# EAGLE design vcf-v1 (EAGLE 9.5.2)
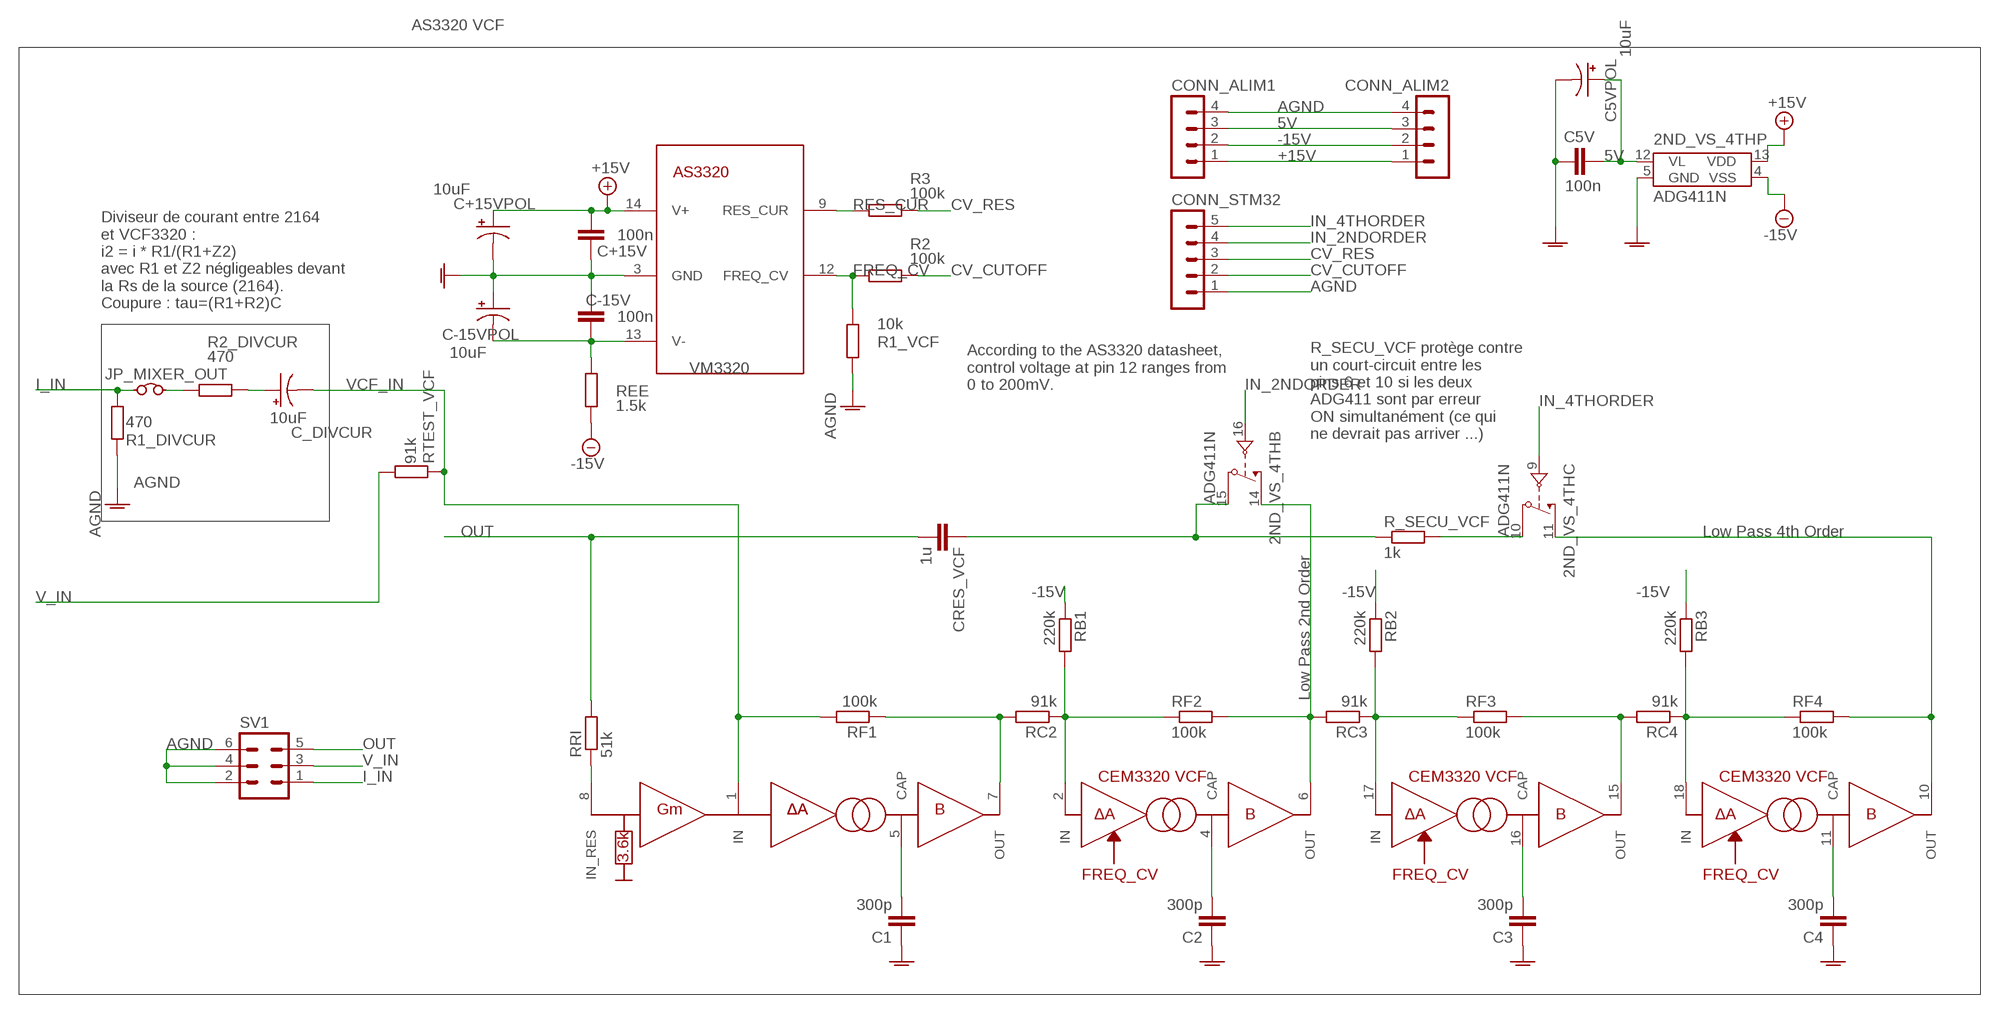
[diagram p0: schematic, sheet 1]

## Parts
2ND_VS_4TH  ADG411N  [DIL16]
C1  300p  C-EU050-024X044  [C050-024X044]
C2  300p  C-EU050-024X044  [C050-024X044]
C3  300p  C-EU075-032X103  [C075-032X103]
C4  300p  C-EU050-024X044  [C050-024X044]
C5V  100n  C-EU050-024X044  [C050-024X044]
C5VPOL  10uF  10UF-POLAR-RADIAL-2.5MM-KIT-25V-20%  [CPOL-RADIAL-2.5MM-5MM-KIT]
C+15V  100n  C-EU050-024X044  [C050-024X044]
C+15VPOL  10uF  10UF-POLAR-RADIAL-2.5MM-KIT-25V-20%  [CPOL-RADIAL-2.5MM-5MM-KIT]
C-15V  100n  C-EU050-024X044  [C050-024X044]
C-15VPOL  10uF  10UF-POLAR-RADIAL-2.5MM-KIT-25V-20%  [CPOL-RADIAL-2.5MM-5MM-KIT]
C_DIVCUR  10uF  10UF-POLAR-RADIAL-2.5MM-KIT-25V-20%  [CPOL-RADIAL-2.5MM-5MM-KIT]
CONN_ALIM1  MA04-1  [MA04-1]
CONN_ALIM2  MA04-1  [MA04-1]
CONN_STM32  MA05-1  [MA05-1]
CRES_VCF  1u  C-EU050-024X044  [C050-024X044]
JP_MIXER_OUT  JUMPER_WIRE  [JUMPER]
R1_DIVCUR  470  R-EU_0204/5  [0204/5]
R1_VCF  10k  R-EU_0204/5  [0204/5]
R2  100k  R-EU_0204/5  [0204/5]
R2_DIVCUR  470  R-EU_0204/5  [0204/5]
R3  100k  R-EU_0204/5  [0204/5]
R_SECU_VCF  1k  R-EU_0204/5  [0204/5]
RB1  220k  R-EU_0204/5  [0204/5]
RB2  220k  R-EU_0204/5  [0204/5]
RB3  220k  R-EU_0204/5  [0204/5]
RC2  91k  R-EU_0204/5  [0204/5]
RC3  91k  R-EU_0204/5  [0204/5]
RC4  91k  R-EU_0204/5  [0204/5]
REE  1.5k  R-EU_0204/5  [0204/5]
RF1  100k  R-EU_0204/5  [0204/5]
RF2  100k  R-EU_0204/5  [0204/5]
RF3  100k  R-EU_0204/5  [0204/5]
RF4  100k  R-EU_0204/5  [0204/5]
RRI  51k  R-EU_0204/5  [0204/5]
RTEST_VCF  91k  R-EU_0204/5  [0204/5]
SV1  MA03-2  [MA03-2]
VCF  AS3320  [DIL18]

## Nets
5V: 2ND_VS_4TH.12(P:VL) C5V.1 C5VPOL.1(+) CONN_ALIM1.3 CONN_ALIM2.3
+15V: 2ND_VS_4TH.13(P:VDD) C+15V.2 C+15VPOL.1(+) CONN_ALIM1.1 CONN_ALIM2.1 VCF.14(POW$1:V+)
-15V: 2ND_VS_4TH.4(P:VSS) CONN_ALIM1.2 CONN_ALIM2.2 RB1.1 RB2.1 RB3.1 REE.1
AGND: 2ND_VS_4TH.5(P:GND) C1.1 C2.1 C3.1 C4.1 C5V.2 C5VPOL.2(-) C+15V.1 C+15VPOL.2(-) C-15V.2 C-15VPOL.1(+) CONN_ALIM1.4 CONN_ALIM2.4 CONN_STM32.1 R1_DIVCUR.2 R1_VCF.2 SV1.2 SV1.4 SV1.6 VCF.3(POW$1:GND)
CV_CUTOFF: CONN_STM32.2 R2.2
CV_RES: CONN_STM32.3 R3.2
FREQ_CV: R1_VCF.1 R2.1 VCF.12(POW$1:FREQ_CV)
I_IN: JP_MIXER_OUT.1 R1_DIVCUR.1 SV1.1
IN_2NDORDER: 2ND_VS_4TH.16(B:IN) CONN_STM32.4
IN_4THORDER: 2ND_VS_4TH.9(C:IN) CONN_STM32.5
N$5: C1.2 VCF.5(OTA$1:CAP)
N$17: C3.2 VCF.16(OTA$4:CAP)
N$18: C2.2 VCF.4(OTA$2:CAP)
N$24: C4.2 VCF.11(OTA$3:CAP)
N$57: RC2.2 RF1.1 VCF.7(OTA$1:OUT)
N$58: 2ND_VS_4TH.15(B:D) CRES_VCF.1 R_SECU_VCF.1
N$62: RB1.2 RC2.1 RF2.1 VCF.2(OTA$2:IN)
N$65: 2ND_VS_4TH.14(B:S) RC3.2 RF2.2 VCF.6(OTA$2:OUT)
N$69: 2ND_VS_4TH.11(C:S) RF4.2 VCF.10(OTA$3:OUT)
N$72: RB2.2 RC3.1 RF3.1 VCF.17(OTA$4:IN)
N$73: 2ND_VS_4TH.10(C:D) R_SECU_VCF.2
N$75: C_DIVCUR.1(+) R2_DIVCUR.1
N$79: JP_MIXER_OUT.2 R2_DIVCUR.2
N$82: RC4.2 RF3.2 VCF.15(OTA$4:OUT)
N$83: RB3.2 RC4.1 RF4.1 VCF.18(OTA$3:IN)
N$86: RRI.1 VCF.8(OTA$1:IN_RES)
OUT: CRES_VCF.2 RRI.2 SV1.5
RES_CUR: R3.1 VCF.9(POW$1:RES_CUR)
V_IN: RTEST_VCF.1 SV1.3
VCF_IN: C_DIVCUR.2(-) RF1.2 RTEST_VCF.2 VCF.1(OTA$1:IN)
VM3320: C-15V.1 C-15VPOL.2(-) REE.2 VCF.13(POW$1:V-)
Unconnected: 2ND_VS_4TH.1(A:IN) 2ND_VS_4TH.2(A:D) 2ND_VS_4TH.3(A:S) 2ND_VS_4TH.6(D:S) 2ND_VS_4TH.7(D:D) 2ND_VS_4TH.8(D:IN)

## Notes on the sheet
- AS3320 VCF
- Diviseur de courant entre 2164 
  et VCF3320 : 
  i2 = i * R1/(R1+Z2)
  avec R1 et Z2 négligeables devant
  la Rs de la source (2164).
  Coupure : tau=(R1+R2)C
- According to the AS3320 datasheet, 
  control voltage at pin 12 ranges from
  0 to 200mV.
- R_SECU_VCF protège contre 
  un court-circuit entre les 
  pins 6 et 10 si les deux 
  ADG411 sont par erreur 
  ON simultanément (ce qui 
  ne devrait pas arriver ...)
- Low Pass 4th Order
- Low Pass 2nd Order

## Library data of the parts
2ND_VS_4TH = analog-devices:ADG411: LC2MOS Precision Quad SPST Switches Source: http://www.analog.com/static/imported-files/data_sheets/ADG411_412_413.pdf; MF: ALTERA CORPORATION; MPN: ADG411BN; OC_FARNELL: 1424317; OC_NEWARK: 05F6198
C1-C4 C5V C+15V C-15V CRES_VCF = rcl:C-EU: CAPACITOR, European symbol; SPICEPREFIX: C
C5VPOL C+15VPOL C-15VPOL C_DIVCUR = SparkFun-Capacitors:10UF-POLAR: 10.0µF polarized capacitors A capacitor is a passive two-terminal electrical component used to store electrical energy temporarily in an electric field.; PROD_ID: CAP-08440
CONN_ALIM1 CONN_ALIM2 = con-lstb:MA04-1: PIN HEADER; OC_FARNELL: unknown; OC_NEWARK: unknown
CONN_STM32 = con-lstb:MA05-1: PIN HEADER; OC_FARNELL: unknown; OC_NEWARK: unknown
JP_MIXER_OUT = 6P1_EVB:JUMPER: Wire jumper .1" C
R1_DIVCUR R1_VCF R2 R2_DIVCUR R3 R_SECU_VCF RB1-RB3 RC2-RC4 REE RF1-RF4 RRI RTEST_VCF = rcl:R-EU_: RESISTOR, European symbol; SPICEPREFIX: R
SV1 = con-lstb:MA03-2: PIN HEADER; OC_FARNELL: unknown; OC_NEWARK: unknown
VCF = analog-audio-chips:AS3320: Voltage Controlled Filter capable of 4th order LP, BP or HP designed by famous audio chips designer Curtis Electronics.

## Board
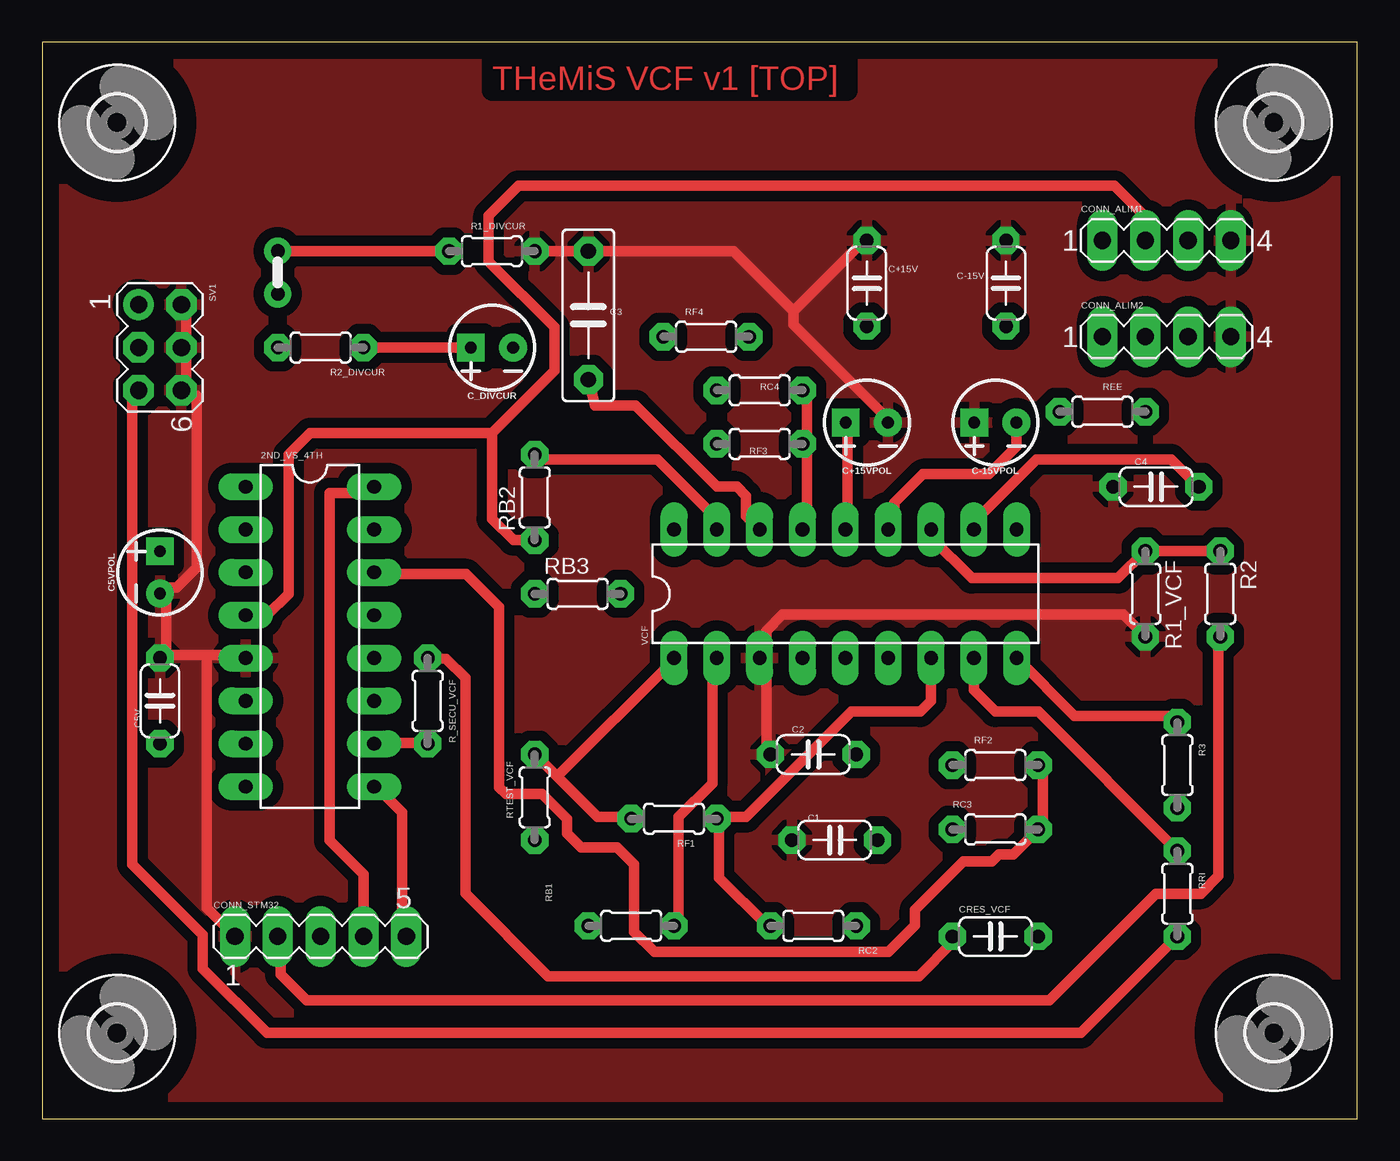
[diagram p1: board, top side]
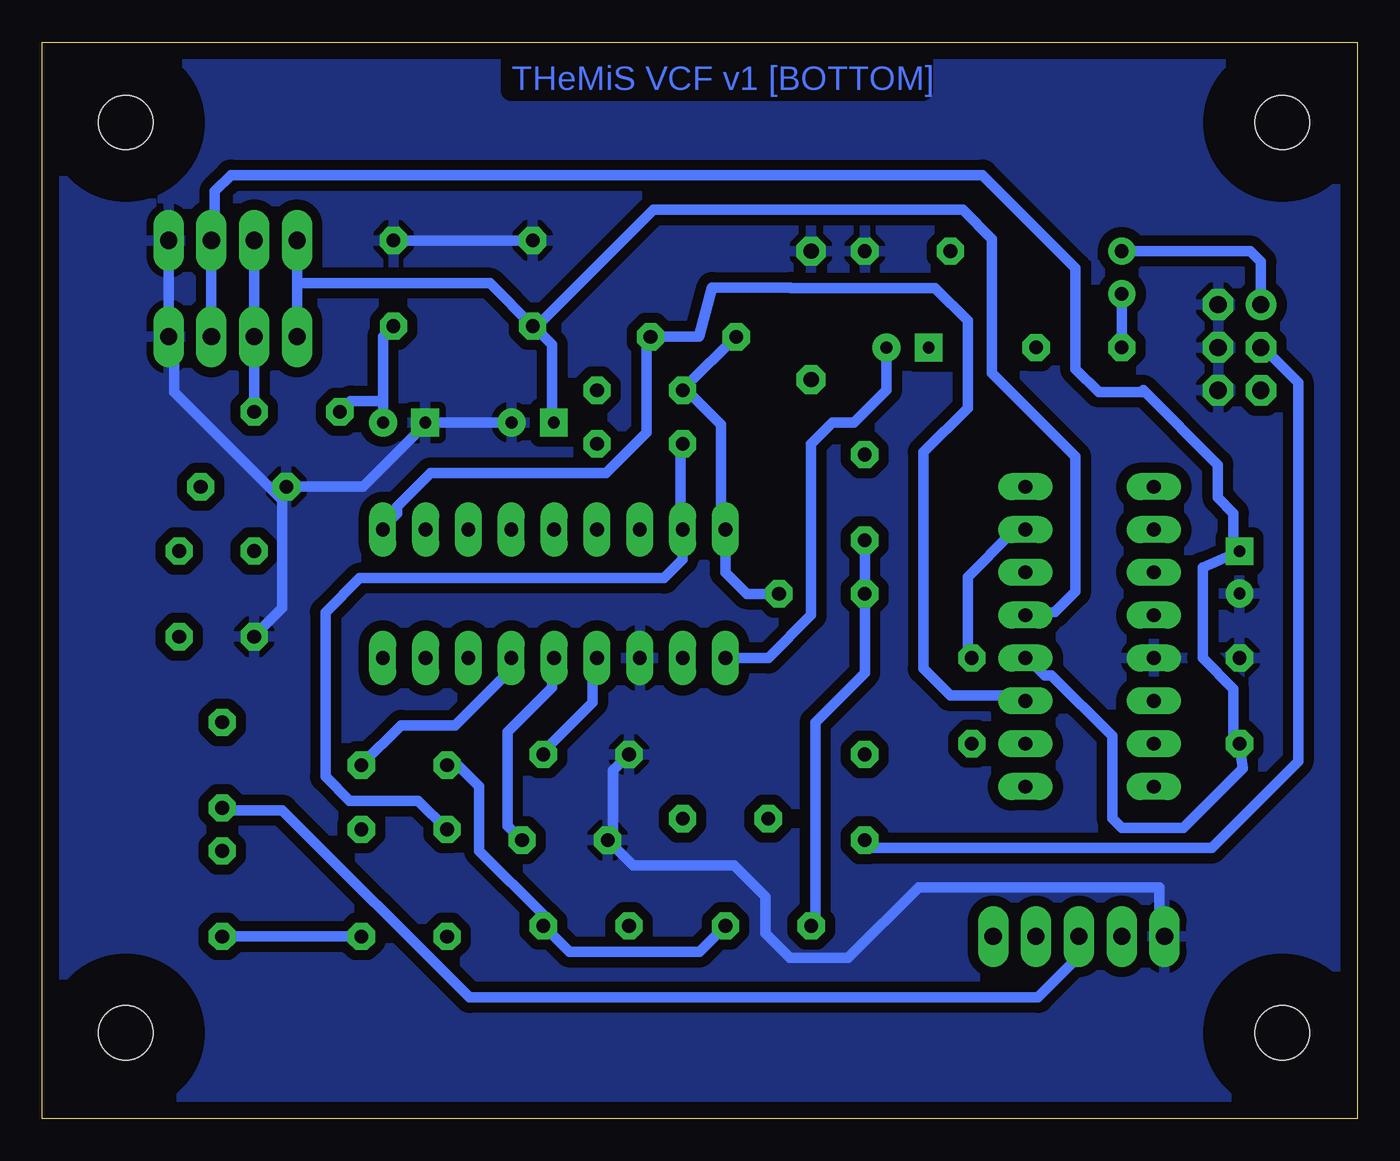
[diagram p2: board, bottom side, seen from below]

Size 77.98 x 63.82 mm. Coordinates in mm from the lower left corner, seen from the top.
Outline: 0,0 77.98,0 77.98,63.82 0,63.82 0,0
Copper layers (1*16): Top 0.035mm / dielectric 1.5mm / Bottom 0.035mm
Design rules "ENSEA_2019": minimum track width 0.4mm, minimum drill 0.6mm, track to track 0.4mm, track to pad 0.4mm, pad to pad 0.4mm, via to via 0.4mm, smd to smd 0.4mm, copper to edge 1mm, drill to drill 0.4mm, minimum pad ring 0.4mm, minimum via ring 0.4mm, stop-mask expansion 4mil, vias tented up to drill 0mil, thermal gap 0.4mm

### Footprints (pad centres in the part's own frame; a part is rotated, then mirrored left to right if it is on the bottom)
DIL16 = drill 0.813 long: 1 -8.89,-3.81; 2 -6.35,-3.81; 3 -3.81,-3.81; 4 -1.27,-3.81; 5 1.27,-3.81; 6 3.81,-3.81; 7 6.35,-3.81; 8 8.89,-3.81; 9 8.89,3.81; 10 6.35,3.81; 11 3.81,3.81; 12 1.27,3.81; 13 -1.27,3.81; 14 -3.81,3.81; 15 -6.35,3.81; 16 -8.89,3.81
C050-024X044 = drill 0.813 octagon: 1 -2.54,0; 2 2.54,0
C075-032X103 = drill 0.914 octagon: 1 -3.81,0; 2 3.81,0
CPOL-RADIAL-2.5MM-5MM-KIT = drill 0.7 pad 1.651 square: 1 1.25,0 | drill 0.7 pad 1.651: 2 -1.25,0
MA04-1 = drill 1.016 long: 1 -3.81,0; 2 -1.27,0; 3 1.27,0; 4 3.81,0
MA05-1 = drill 1.016 long: 1 -5.08,0; 2 -2.54,0; 3 0,0; 4 2.54,0; 5 5.08,0
JUMPER = drill 0.813: 1 -1.27,0; 2 1.27,0
0204/5 = drill 0.813 octagon: 1 -2.54,0; 2 2.54,0
MA03-2 = drill 1.016: 1 -2.54,-1.27 | drill 1.016 octagon: 2 -2.54,1.27; 3 0,-1.27; 4 0,1.27; 5 2.54,-1.27; 6 2.54,1.27
3,2 = hole 3.2: 0,0
DIL18 = drill 0.813 long: 1 -10.16,-3.81; 2 -7.62,-3.81; 3 -5.08,-3.81; 4 -2.54,-3.81; 5 0,-3.81; 6 2.54,-3.81; 7 5.08,-3.81; 8 7.62,-3.81; 9 10.16,-3.81; 10 10.16,3.81; 11 7.62,3.81; 12 5.08,3.81; 13 2.54,3.81; 14 0,3.81; 15 -2.54,3.81; 16 -5.08,3.81; 17 -7.62,3.81; 18 -10.16,3.81

### Placement (x,y rotation side)
2ND_VS_4TH  15.88,28.58 270 top
C1  46.99,16.51 0 top
C2  45.72,21.59 0 top
C3  32.38,47.62 270 top
C4  66.04,37.46 0 top
C5V  6.99,24.77 90 top
C5VPOL  6.99,32.38 90 top
C+15V  48.89,49.53 270 top
C+15VPOL  48.89,41.27 180 top
C-15V  57.15,49.53 90 top
C-15VPOL  56.52,41.27 180 top
C_DIVCUR  26.67,45.72 180 top
CONN_ALIM1  66.68,52.07 0 top
CONN_ALIM2  66.68,46.35 0 top
CONN_STM32  16.51,10.79 0 top
CRES_VCF  56.52,10.79 0 top
JP_MIXER_OUT  13.97,50.16 270 top
R1_DIVCUR  26.67,51.43 0 top
R1_VCF  65.41,31.12 270 top
R2  69.85,31.12 270 top
R2_DIVCUR  16.51,45.72 180 top
R3  67.31,20.95 270 top
R_SECU_VCF  22.86,24.77 270 top
RB1  34.92,11.43 0 top
RB2  29.21,36.83 90 top
RB3  31.75,31.12 0 top
RC2  45.72,11.43 180 top
RC3  56.52,17.14 0 top
RC4  42.55,43.18 0 top
REE  62.87,41.91 180 top
RF1  37.46,17.78 180 top
RF2  56.52,20.95 0 top
RF3  42.55,40 0 top
RF4  39.37,46.35 0 top
RRI  67.31,13.34 270 top
RTEST_VCF  29.21,19.05 90 top
SV1  6.99,45.72 270 top
U$1  [3,2]  4.45,59.05 0 top
U$2  [3,2]  73.03,59.05 0 top
U$3  [3,2]  73.03,5.08 0 top
U$4  [3,2]  4.45,5.08 0 top
VCF  47.62,31.12 0 top

### Tracks (layer width: path | path; a pad name or v marks a point on that pad's centre or on a via)
5V
  Bottom 0.61: 2ND_VS_4TH.12 19.34,27.08 18.54,26.28 18.14,26.28 14.54,22.68 14.54,17.81 13.98,17.24 10.3,17.24 6.79,20.76 C5V.1 7.34,22.28 7.34,25.48 9.18,27.31 9.18,32.68 C5VPOL.1 7.34,33.88 7.34,35.88 8.27,36.81 8.27,38.75 12.7,43.18 12.8,43.08 15.34,43.08 16.7,44.45 16.7,50.43 22.22,55.95 66.78,55.95 67.74,54.98 67.74,52.28 CONN_ALIM1.3 CONN_ALIM2.3
+15V
  Top 0.61: VCF.14 47.74,35.08 47.74,41.08 C+15VPOL.1
  Bottom 0.61: 2ND_VS_4TH.13 17.93,30.02 16.7,31.24 16.7,39.24 21.67,44.21 21.67,52.15 23.4,53.88 41.74,53.88 48.63,46.99 C+15V.2 | C+15VPOL.1 47.74,41.48 47.74,45.88 48.54,46.68 C+15V.2 | C+15V.2 51.44,49.53 62.87,49.53 | 62.87,49.53 CONN_ALIM1.1 | 62.87,49.53 CONN_ALIM2.1
-15V
  Top 0.61: 12.14,29.88 2ND_VS_4TH.4 13.34,29.84 14.61,31.12 14.61,39.37 15.88,40.64 26.67,40.64 | 26.67,40.64 26.67,35.56 27.94,34.29 RB2.1 | CONN_ALIM1.2 65.41,53.48 63.57,55.31 28.23,55.31 26.47,53.55 26.47,50.82 30.38,46.91 30.38,44.34 26.67,40.64
  Bottom 0.61: RB2.1 RB3.1 29.21,26.42 32.14,23.49 32.14,11.68 RB1.1 | CONN_ALIM1.2 CONN_ALIM2.2 REE.1
AGND
  Top 0.61: SV1.2 8.54,47.88 8.54,45.88 SV1.4 8.54,45.48 8.54,43.48 SV1.6 9.18,42.86 9.18,32.68 7.97,31.48 7.34,31.48 C5VPOL.2 7.34,31.08 7.34,27.48 | 7.34,27.48 9.74,27.48 | 9.74,27.48 11.74,27.48 2ND_VS_4TH.5 | 7.34,27.48 C5V.2 | C2.1 42.94,21.88 42.94,27.08 VCF.3 42.94,27.7 42.94,28.91 43.91,29.88 64.1,29.88 R1_VCF.2 | 44.54,47.88 44.54,47.08 50.14,41.48 C+15VPOL.2 | 9.74,27.48 9.74,12.48 CONN_STM32.1 | C+15V.1 48.73,52.07 44.54,47.88 | 44.54,47.88 40.98,51.43 C3.1 R1_DIVCUR.2
  Bottom 0.61: 63.74,36.68 63.74,30.28 65.34,28.68 R1_VCF.2 | 63.74,36.68 63.74,37.08 C4.1 | C4.1 63.34,37.48 58.94,37.48 55.34,41.08 C-15VPOL.1 C+15VPOL.2 | 63.74,36.68 70.14,43.08 70.14,46.28 CONN_ALIM2.4 CONN_ALIM1.4 | 63.74,36.68 C4.1 | CONN_STM32.1 11.74,11.11 11.74,13.71 26,13.71 30.19,9.53 33.66,9.53 35.11,10.98 35.11,13.15 36.96,15.01 42.95,15.01 C1.1 44.14,16.82 44.14,20.63 C2.1 | C+15V.1 C-15V.2
  pour Bottom (isolate 0.61): 0,63.5 77.47,63.5 77.47,0 0,0
  pour Top (isolate 0.61): 0,63.5 78.11,63.5 78.11,0 0,0
CV_CUTOFF
  Top 0.61: CONN_STM32.2 14.14,10.62 14.14,8.54 15.67,7.01 59.71,7.01 66.04,13.34 68.7,13.34 69.74,14.38 69.74,28.47 R2.2
CV_RES
  Bottom 0.61: CONN_STM32.3 16.51,9.61 18.94,7.18 52.63,7.18 63.74,18.28 67.18,18.28 R3.2
FREQ_CV
  Top 0.61: R2.1 R1_VCF.1 63.8,32.05 55.12,32.05 52.7,34.45 VCF.12
I_IN
  Top 0.61: R1_DIVCUR.1 JP_MIXER_OUT.1
  Bottom 0.61: SV1.1 5.71,50.8 6.35,51.43 JP_MIXER_OUT.1
IN_2NDORDER
  Top 0.61: 2ND_VS_4TH.16 19.3,37.08 17.04,37.08 17.04,16.49 19.05,14.47 CONN_STM32.4
IN_4THORDER
  Top 0.61: 2ND_VS_4TH.9 19.81,19.69 21.34,18.16 21.34,11.01 CONN_STM32.5
N$5
  Bottom 0.61: C1.2 50.38,17.36 50.38,22.91 47.74,25.55 47.74,27.19 VCF.5
N$17
  Top 0.61: VCF.16 41.74,35.73 41.74,36.91 41.19,37.46 40.01,37.46 35.19,42.28 32.79,42.28 C3.2
N$18
  Bottom 0.61: C2.2 48.26,21.76 45.34,24.68 45.34,27.05 VCF.4
N$24
  Top 0.61: C4.2 68.56,37.46 66.94,39.08 58.94,39.08 55.24,35.38 VCF.11
N$57
  Top 0.61: RC2.2 42.94,11.48 40.14,14.28 40.14,17.48 RF1.1 40.1,17.88 41.74,17.88 47.99,24.13 52.07,24.13 52.7,24.77 VCF.7
N$58
  Top 0.61: CRES_VCF.1 53.98,10.45 51.98,8.45 30,8.45 25.11,13.34 25.11,26.12 23.96,27.26 R_SECU_VCF.1
  Bottom 0.61: 2ND_VS_4TH.15 19.74,34.68 20.54,34.68 23.11,32.12 23.11,27.41 R_SECU_VCF.1
N$62
  Top 0.61: VCF.2 39.74,27.08 39.74,19.88 37.74,17.88 37.74,11.48 RB1.2
  Bottom 0.61: RB1.2 39.02,9.88 46.71,9.88 RC2.1 48.26,12.07 52.07,15.88 52.07,19.69 53.34,20.95 RF2.1
N$65
  Top 0.61: RF2.2 59.34,20.68 59.34,17.48 RC3.2 57.57,15.67 56.73,15.67 56.3,15.24 54.61,15.24 51.75,12.38 51.75,11.47 50.16,9.88 36.3,9.88 35.1,11.08 35.1,15.06 34.09,16.07 31.95,16.07 31.11,16.91 31.11,17.78 29.65,19.25 27.5,19.25 27.11,19.64 27.11,30.33 25.15,32.28 19.74,32.28 2ND_VS_4TH.14
  Bottom 0.61: VCF.6 50.54,26.93 50.54,26.28 53.51,23.31 56.7,23.31 RF2.2
N$69
  Bottom 0.61: 2ND_VS_4TH.11 19.74,25.08 24.14,25.08 25.74,26.68 25.74,39.5 23.11,42.14 23.11,47.31 25.04,49.24 33.58,49.24 33.6,49.27 38.26,49.27 39.03,46.35 RF4.2 42.14,46 42.14,40.68 44.54,38.28 54.94,38.28 56.94,36.28 56.94,35.88 57.74,35.08 VCF.10
N$72
  Top 0.61: VCF.17 40.01,35.56 36.48,39.08 29.5,39.08 RB2.2
  Bottom 0.61: RF3.1 40.14,39.88 40.14,35.08 VCF.17 40.01,33.15 41.1,32.05 59.15,32.05 61.17,30.02 61.17,20.28 59.74,18.84 55.67,18.84 RC3.1
N$73
  Top 0.61: 2ND_VS_4TH.10 19.74,22.28 22.47,22.28 R_SECU_VCF.2
N$75
  Top 0.61: C_DIVCUR.1 R2_DIVCUR.1
N$79
  Bottom 0.61: JP_MIXER_OUT.2 R2_DIVCUR.2
N$82
  Top 0.61: VCF.15 45.34,35.08 45.34,39.88 RF3.2 45.34,40.28 45.34,43.08 RC4.2
N$83
  Bottom 0.61: RF4.1 36.91,46.27 36.94,46.28 39.74,43.48 RC4.1 39.77,43.18 37.74,41.15 37.74,35.08 VCF.18 37.46,32.38 36.2,31.12 RB3.2
N$86
  Top 0.61: VCF.8 55.24,25.4 56.52,24.13 59.05,24.13 RRI.1
OUT
  Top 0.61: SV1.5 5.34,42.8 5.34,15.08 9.53,10.89 9.53,8.89 13.34,5.08 61.59,5.08 RRI.2
  Bottom 0.61: RRI.2 CRES_VCF.2
RES_CUR
  Top 0.61: R3.1 66.93,23.88 61.21,23.88 VCF.9
V_IN
  Bottom 0.61: RTEST_VCF.1 28.74,16.05 8.63,16.05 3.5,21.17 3.5,43.64 5.34,45.48 SV1.3
VCF_IN
  Top 0.61: 30.54,20.28 29.34,21.48 RTEST_VCF.2 | 30.54,20.28 32.94,17.88 34.54,17.88 RF1.2 | 30.54,20.28 37.34,27.08 VCF.1
  Bottom 0.61: 27.74,45.48 C_DIVCUR.2 27.92,43.2 29.84,41.27 31.11,41.27 32.38,40 32.38,29.84 34.92,27.3 VCF.1 37.34,27.48
VM3320
  Top 0.61: C-15VPOL.2 57.77,39.84 56.14,38.21 52.23,38.21 50.54,36.52 50.54,35.3 VCF.13
  Bottom 0.61: C-15VPOL.2 57.77,42.55 | 57.77,42.55 57.77,46.38 C-15V.1 | REE.2 59.69,42.55 57.77,42.55

### Text on the board
Top: THeMiS VCF v1 [TOP]
Bottom: THeMiS VCF v1 [BOTTOM]